# Altium schematic sheet PSU_VCC1V8_Buck.SchDoc
size A3; SheetNumber: 4; SheetTotal: 32
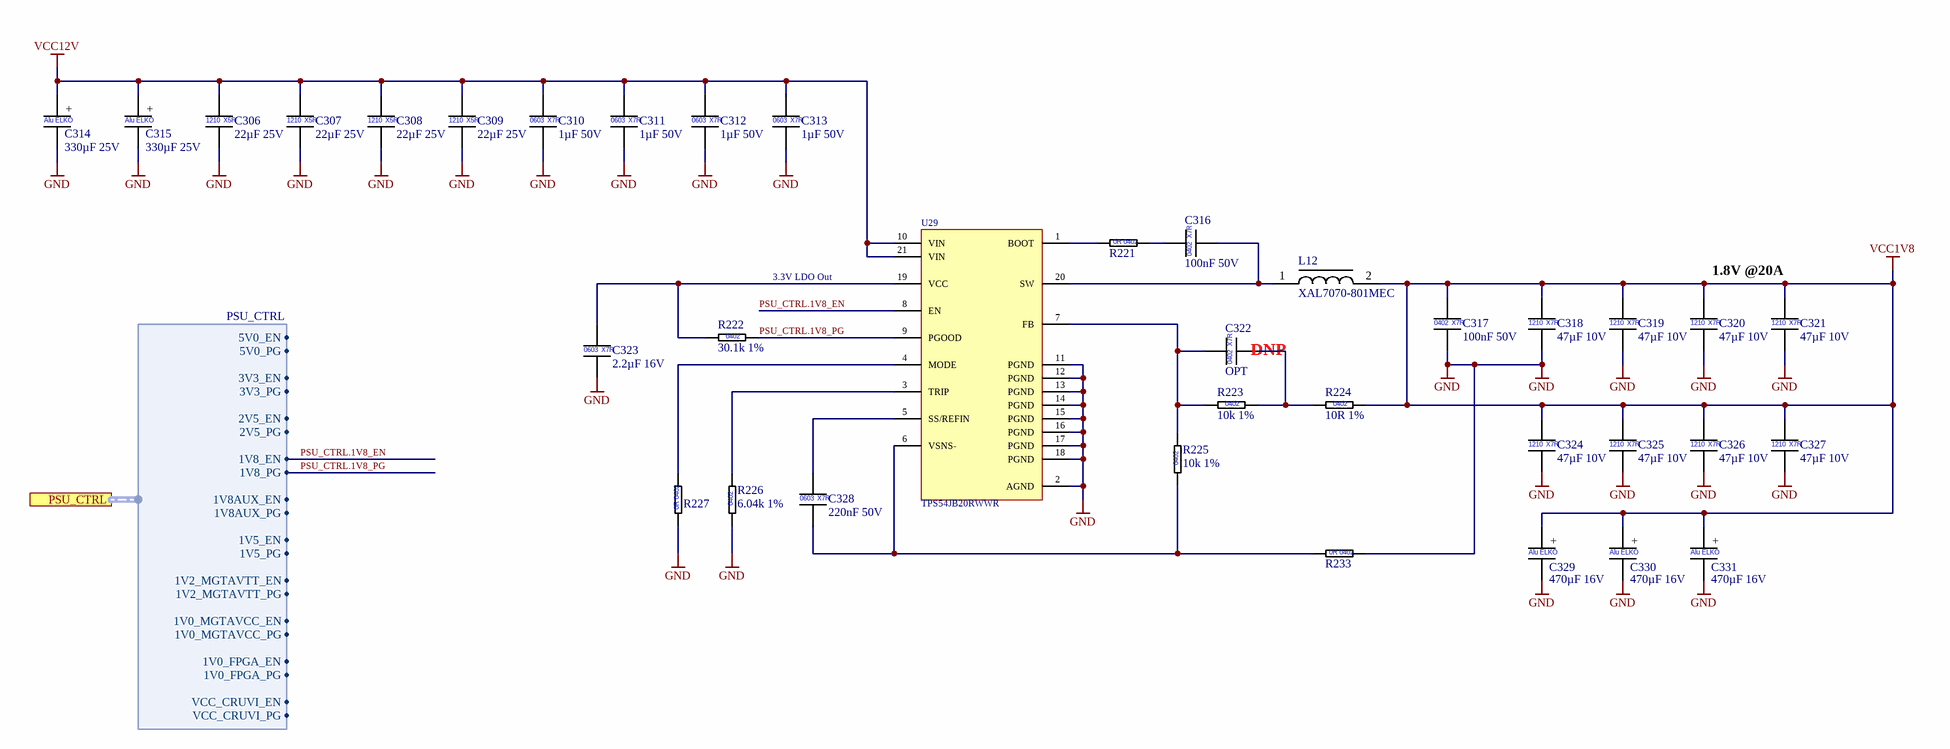
[diagram p0: PSU_VCC1V8_Buck.SchDoc]

## Parts
C306  22µF 25V  [CAP_1210]
C307  22µF 25V  [CAP_1210]
C308  22µF 25V  [CAP_1210]
C309  22µF 25V  [CAP_1210]
C310  1µF 50V  [CAP_0603]
C311  1µF 50V  [CAP_0603]
C312  1µF 50V  [CAP_0603]
C313  1µF 50V  [CAP_0603]
C314  330µF 25V  [WCAP-PTG5_D10H12.5]
C315  330µF 25V  [WCAP-PTG5_D10H12.5]
C316  100nF 50V  [CAP_0402]
C317  100nF 50V  [CAP_0402]
C318  47µF 10V  [CAP_1210]
C319  47µF 10V  [CAP_1210]
C320  47µF 10V  [CAP_1210]
C321  47µF 10V  [CAP_1210]
C322  OPT  [CAP_0402]  (no BOM)
C323  2.2µF 16V  [CAP_0603]
C324  47µF 10V  [CAP_1210]
C325  47µF 10V  [CAP_1210]
C326  47µF 10V  [CAP_1210]
C327  47µF 10V  [CAP_1210]
C328  220nF 50V  [CAP_0603]
C329  470µF 16V  [WCAP-PTG5_D8H13]
C330  470µF 16V  [WCAP-PTG5_D8H13]
C331  470µF 16V  [WCAP-PTG5_D8H13]
L12  XAL7070-801MEC  [COILCRAFT_XAL7070]
R221  0R Jumper  [RES_0402]  (value not drawn)
R222  30.1k 1%  [RES_0402]
R223  10k 1%  [RES_0402]
R224  10R 1%  [RES_0402]
R225  10k 1%  [RES_0402]
R226  6.04k 1%  [RES_0402]
R227  0R Jumper  [RES_0402]  (value not drawn)
R233  0R Jumper  [RES_0402]  (value not drawn)
U29  TPS54JB20RWWR  [VQFN-HR21_RWW0021A]

## Ports
PSU_CTRL (harness PSU_CTRL, see Power-Tree[2C], PSU_MGTAVCC_Buck[1B], PSU_MGTAVTT_Buck[1B], PSU_VCC1V0_FPGA_Buck[1B], PSU_VCC1V5_Buck[1B], PSU_VCC1V8AUX_Buck[1B], PSU_VCC2V5_Buck[1B], PSU_VCC3V3_Buck[1B], PSU_VCC5V_Buck[1B], PSU_VCC_CRUVI_ADJ_Buck[1B])

## Harnesses
PSU_CTRL: 5V0_EN, 5V0_PG, 3V3_EN, 3V3_PG, 2V5_EN, 2V5_PG, 1V8_EN, 1V8_PG, 1V8AUX_EN, 1V8AUX_PG, 1V5_EN, 1V5_PG, 1V2_MGTAVTT_EN, 1V2_MGTAVTT_PG, 1V0_MGTAVCC_EN, 1V0_MGTAVCC_PG, 1V0_FPGA_EN, 1V0_FPGA_PG, VCC_CRUVI_EN, VCC_CRUVI_PG

## Nets
GND: C306.2 C307.2 C308.2 C309.2 C310.2 C311.2 C312.2 C313.2 C314.2 C315.2 C317.2 C318.2 C319.2 C320.2 C321.2 C323.2 C324.2 C325.2 C326.2 C327.2 C329.2 C330.2 C331.2 R226.1 R227.1 R233.2 U29.2(AGND) U29.11(PGND) U29.12(PGND) U29.13(PGND) U29.14(PGND) U29.15(PGND) U29.16(PGND) U29.17(PGND) U29.18(PGND)
VCC1V8: C317.1 C318.1 C319.1 C320.1 C321.1 C324.1 C325.1 C326.1 C327.1 C329.1 C330.1 C331.1 L12.2 R224.2
VCC12V: C306.1 C307.1 C308.1 C309.1 C310.1 C311.1 C312.1 C313.1 C314.1 C315.1 U29.10(VIN) U29.21(VIN)
PSU_CTRL.1V8_EN: U29.8(EN) ; port PSU_CTRL.1V8_EN
PSU_CTRL.1V8_PG: R222.2 U29.9(PGOOD) ; port PSU_CTRL.1V8_PG
NetC316_1: C316.1 R221.2
NetC316_2: C316.2 L12.1 U29.20(SW)
NetC322_1: C322.1 R223.1 R225.2 U29.7(FB)
NetC322_2: C322.2 R223.2 R224.1
NetC323_1: C323.1 R222.1 U29.19(VCC)
NetC328_1: C328.1 U29.5(SS/REFIN)
NetC328_2: C328.2 R225.1 R233.1 U29.6(VSNS-)
NetR221_1: R221.1 U29.1(BOOT)
NetR226_2: R226.2 U29.3(TRIP)
NetR227_2: R227.2 U29.4(MODE)

## Notes on the sheet
- 3.3V LDO Out
- (near C321) 1.8V @20A
- (near C322) DNP
- Company:
- Contact:
- Customer:
- mail@pcb-arts.com
- PCB Arts GmbH
- Title:
- Project:
- The  information  contained  in  these  documents  is  confidential,  privileged  and  only  for  the information of the intended recipient and may not be used, published or redistributed Without the prior written consent from PCB Arts GmbH.
- Engineer:
- Document Number:
- Revision:
- Variant:
- Date:
- Time:
- Sheet:
- Status:
- /
- (in symbol CAP_0402_100nF_50V) X7R; 0402
- (in symbol CAP_0402_OPT) X7R; 0402
- (in symbol CAP_0603_1µF_50V_X7R_10%) 0603; X7R
- (in symbol CAP_0603_2.2µF_16V_X7R_10%) 0603; X7R
- (in symbol CAP_0603_220nF_50V_X7R_10%) 0603; X7R
- (in symbol CAP_1210_22µF_25V) 1210; X5R
- (in symbol CAP_1210_47µF_10V_X7R_10%) 1210; X7R
- (in symbol CAP_D8L9_470µF_16V) +; Alu ELKO
- (in symbol CAP_D10L12.5_330µF_25V) +; Alu ELKO
- (in symbol RES_0402_0R Jumper) 0R 0402
- (in symbol RES_0402_6.04k_1%) 0402
- (in symbol RES_0402_10k_1%) 0402
- (in symbol RES_0402_10R_1%) 0402
- (in symbol RES_0402_30.1k_1%) 0402

## Library data of the parts
C306-C309 = CAP_1210_22µF_25V: Multilayer Ceramic Capacitors MLCC - SMD/SMT 1210 25VDC; Manufacturer 1: KEMET; Manufacturer 1 Prt. Nr.: C1210C226K3PACTU; Manufacturer 2 Prt. Nr.: TMK212BBJ226MG-TT; Manufacturer 2: Taiyo Yuden
C310-C313 = CAP_0603_1µF_50V_X7R_10%: Multilayer Ceramic Capacitors MLCC - SMD/SMT 50V 1uF X7R 0603 10%; Manufacturer 1: KYOCERA AVX; Manufacturer 1 Prt. Nr.: 06035C105KAT2A; Manufacturer 2 Prt. Nr.: MSASU168AB7105KTNA01; Manufacturer 2: TAIYO YUDEN
C314 C315 = CAP_D10L12.5_330µF_25V: Organische Polymer-Aluminiumkondensatoren 330uF 25 Volts 20% AEC-Q200; Manufacturer 1: Würth Elektronik; Manufacturer 1 Prt. Nr.: 870025575009
C316 C317 = CAP_0402_100nF_50V: Multilayer Ceramic Capacitors MLCC - SMD/SMT 0402 50VDC; Manufacturer 1: Murata Electronics; Manufacturer 1 Prt. Nr.: GCM155L8EH104KE07D; Manufacturer 2 Prt. Nr.: UMK105B7104KV-FR; Manufacturer 2: TDK
C318-C321 C324-C327 = CAP_1210_47µF_10V_X7R_10%: Multilayer Ceramic Capacitors MLCC - SMD/SMT 47 uF 10 VDC 10% 1210 X7R; Manufacturer 1: Murata Electronics; Manufacturer 1 Prt. Nr.: GRM32ER71A476KE15L; Manufacturer 2 Prt. Nr.: C1210C106K8RACTU; Manufacturer 2: KEMET
C322 = CAP_0402_OPT: Multilayer Ceramic Capacitors MLCC - SMD/SMT 0402 Optional Placeholder
C323 = CAP_0603_2.2µF_16V_X7R_10%: Multilayer Ceramic Capacitors MLCC - SMD/SMT 2.2 uF 16 VDC 10% 0603 X7R; Manufacturer 1: Murata Electronics; Manufacturer 1 Prt. Nr.: GRM188Z71C225KE43D; Manufacturer 2 Prt. Nr.: EMK107BB7225KA-T; Manufacturer 2: TAIYO YUDEN
C328 = CAP_0603_220nF_50V_X7R_10%: Multilayer Ceramic Capacitors MLCC - SMD/SMT 0.22 uF 50 VDC 10% 0603 X7R; Manufacturer 1: Murata Electronics; Manufacturer 1 Prt. Nr.: GRJ188R71H224KE11D; Manufacturer 2 Prt. Nr.: CGA3E3X7R1H224K080AE; Manufacturer 2: TDK
C329-C331 = CAP_D8L9_470µF_16V: Organische Polymer-Aluminiumkondensatoren 470uF 16 Volts 20%; Manufacturer 1: Würth Elektronik; Manufacturer 1 Prt. Nr.: 870025374007
L12 = XAL7070-801MEC_Power Inductors SMD 800nH Shld 20% 25.8A 2.29mOhms AECQ200: Power Inductors - SMD 800nH Shld 20% 25.8A 2.29mOhms AECQ200; Manufacturer 1: Coilcraft; Manufacturer 1 Prt. Nr.: XAL7070-801MEC
R221 R227 R233 = RES_0402_0R Jumper: Thick Film Resistors - SMD 0Ohm; Manufacturer 1: Vishay / Dale; Manufacturer 1 Prt. Nr.: CRCW04020000Z0EDC; Manufacturer 2 Prt. Nr.: RC0402JR-070RL; Manufacturer 2: Yageo
R222 = RES_0402_30.1k_1%: Thick Film Resistors - SMD 30.1kOhm 1%; Manufacturer 1: Vishay / Dale; Manufacturer 1 Prt. Nr.: CRCW040230K1FKEDC; Manufacturer 2 Prt. Nr.: RC0402FR-1330K1L; Manufacturer 2: Yageo
R223 R225 = RES_0402_10k_1%: Thick Film Resistors - SMD 10kOhm 1%; Manufacturer 1: Vishay / Dale; Manufacturer 1 Prt. Nr.: CRCW040210K0FKEDC; Manufacturer 2 Prt. Nr.: RC0402FR-7W10KL; Manufacturer 2: Yageo
R224 = RES_0402_10R_1%: Thick Film Resistors - SMD 10Ohm 1%; Manufacturer 1: Vishay / Dale; Manufacturer 1 Prt. Nr.: CRCW040210R0FKEE; Manufacturer 2 Prt. Nr.: RC0402FR-7W10RL; Manufacturer 2: Yageo
R226 = RES_0402_6.04k_1%: Thick Film Resistors - SMD 6.04kOhm 1%; Manufacturer 1: Vishay / Dale; Manufacturer 1 Prt. Nr.: CRCW04026K04FKEDC; Manufacturer 2 Prt. Nr.: RC0402FR-7W6K04L; Manufacturer 2: Yageo
U29 = TPS54JB20RWWR_Switching Voltage Regulators 2.7-V to 16-V input 20-A synchronous Buck: Switching Voltage Regulators 2.7-V to 16-V input 20-A synchronous Buck; Manufacturer 1: Texas Instruments; Manufacturer 1 Prt. Nr.: TPS54JB20RWWR